# Altium schematic sheet Modulo_Generico.SchDoc
size A4
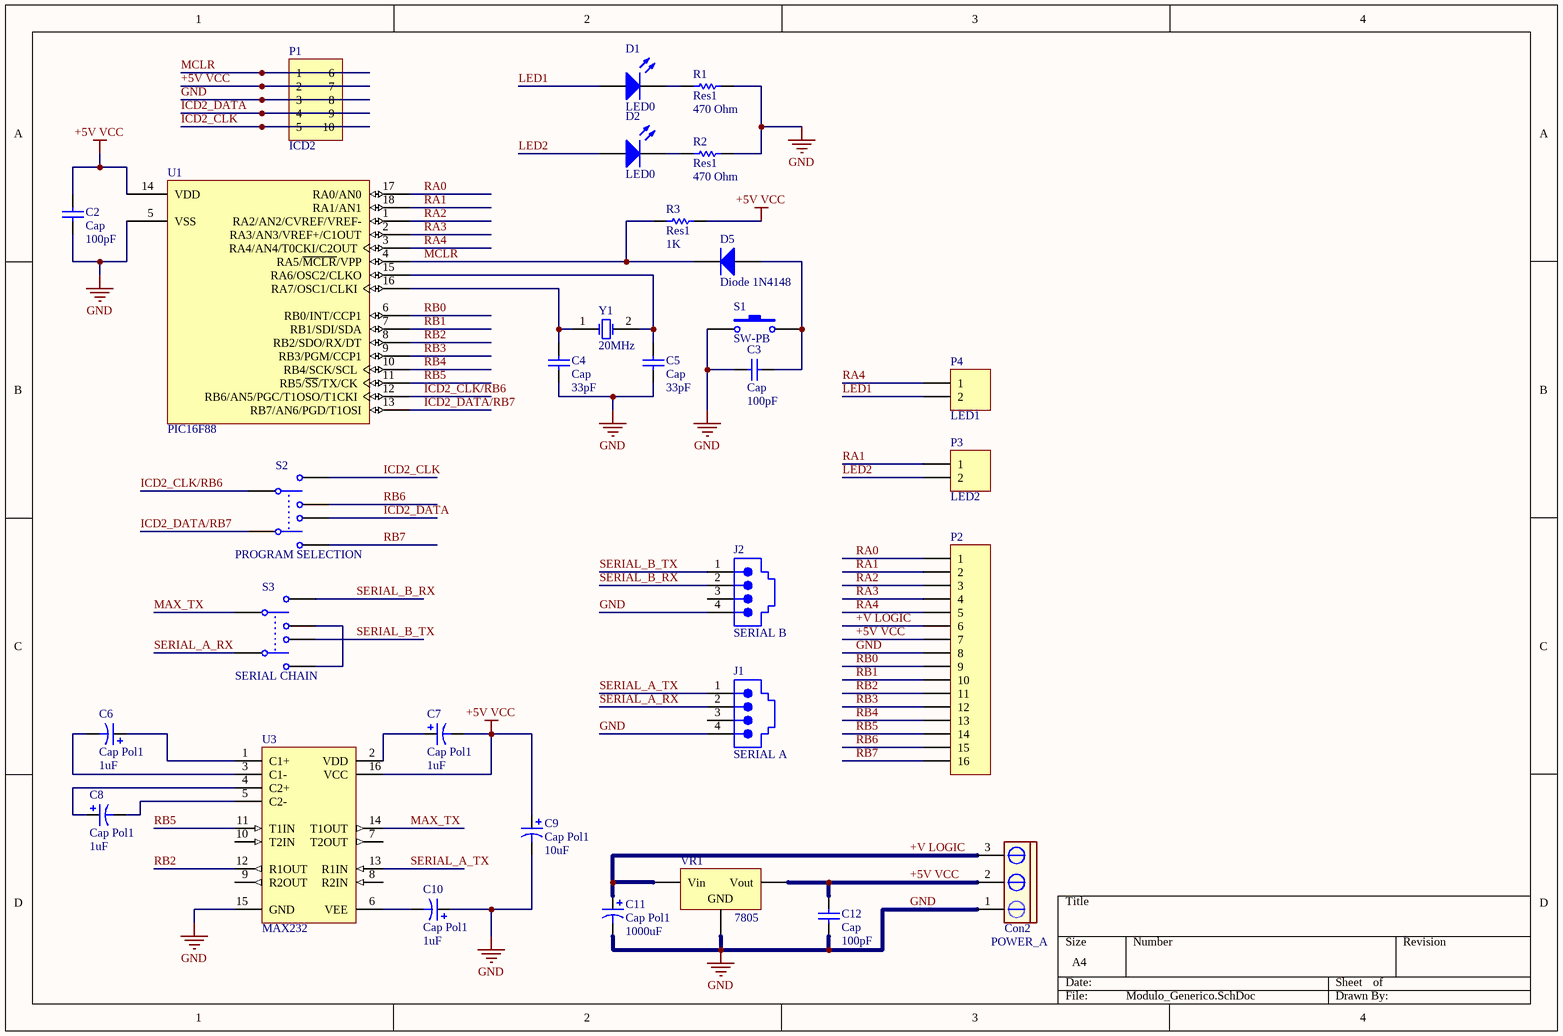
[diagram p0: Modulo_Generico.SchDoc]

## Parts
C2  Cap  value 100pF  [CAPR2.54-5.1x3.2]
C3  Cap  value 100pF  [CAPR2.54-5.1x3.2]
C4  Cap  value 33pF  [CAPR2.54-5.1x3.2]
C5  Cap  value 33pF  [CAPR2.54-5.1x3.2]
C6  Cap Pol1  value 1uF  [CAPPR2-5x6.8]
C7  Cap Pol1  value 1uF  [CAPPR2-5x6.8]
C8  Cap Pol1  value 1uF  [CAPPR2-5x6.8]
C9  Cap Pol1  value 10uF  [CAPPR2-5x6.8]
C10  Cap Pol1  value 1uF  [CAPPR2-5x6.8]
C11  Cap Pol1  value 1000uF  [RB5-10.5]
C12  Cap  value 100pF  [CAPR2.54-5.1x3.2]
Con2  POWER_A  [My_CN3]
D1  LED0  [LED-0]
D2  LED0  [LED-0]
D5  Diode 1N4148  [DIO7.1-3.9x1.9]
J1  SERIAL A  [15-43-6245]
J2  SERIAL B  [15-43-6245]
P1  ICD2  [HEADER10_5x2_B]
P2  Header 16  [My_1X16]  (value not drawn)
P3  LED2  [HDR1X2]
P4  LED1  [HDR1X2]
R1  Res1  value 470 Ohm  [AXIAL-0.3]
R2  Res1  value 470 Ohm  [AXIAL-0.3]
R3  Res1  value 1K  [AXIAL-0.3]
S1  SW-PB  [TS-063]
S2  PROGRAM SELECTION  [LD-202mini]
S3  SERIAL CHAIN  [LD-202mini]
U1  PIC16F88  [PDIP300-P18]
U3  MAX232  [PE16A]
VR1  7805  [My_TO-220]
Y1  20MHz  [My_Crystal]

## Nets
+5V VCC: C2.2 C7.2 C9.1 C12.2 Con2.2 P1.2 P1.7 P2.7 R3.2 U1.14(VDD) U3.16(VCC) VR1.3(Vout)
GND: C2.1 C3.1 C4.1 C5.1 C9.2 C10.1 C11.2 C12.1 Con2.1 J1.4 J2.4 P1.3 P1.8 P2.8 R1.2 R2.2 S1.1 U1.5(VSS) U3.15(GND) VR1.2(GND)
+V LOGIC: C11.1 Con2.3 P2.6 VR1.1(Vin)
ICD2_CLK: P1.5 P1.10 S2.2
ICD2_CLK/RB6: S2.1 U1.12(RB6/AN5/PGC/T1OSO/T1CKI)
ICD2_DATA: P1.4 P1.9 S2.5
ICD2_DATA/RB7: S2.4 U1.13(RB7/AN6/PGD/T1OSI)
LED1: D1.1(A) P4.2
LED2: D2.1(A) P3.2
MAX_TX: S3.1 U3.14(T1OUT)
MCLR: D5.2(K) P1.1 P1.6 R3.1 U1.4(RA5/~{MCLR}/VPP)
RA0: P2.1 U1.17(RA0/AN0)
RA1: P2.2 P3.1 U1.18(RA1/AN1)
RA2: P2.3 U1.1(RA2/AN2/CVREF/VREF-)
RA3: P2.4 U1.2(RA3/AN3/VREF+/C1OUT)
RA4: P2.5 P4.1 U1.3(RA4/AN4/T0CKI/C2OUT)
RB0: P2.9 U1.6(RB0/INT/CCP1)
RB1: P2.10 U1.7(RB1/SDI/SDA)
RB2: P2.11 U1.8(RB2/SDO/RX/DT) U3.12(R1OUT)
RB3: P2.12 U1.9(RB3/PGM/CCP1)
RB4: P2.13 U1.10(RB4/SCK/SCL)
RB5: P2.14 U1.11(RB5/~{SS}/TX/CK) U3.11(T1IN)
RB6: P2.15 S2.3
RB7: P2.16 S2.6
SERIAL_A_RX: J1.2 S3.4
SERIAL_A_TX: J1.1 U3.13(R1IN)
SERIAL_B_RX: J2.2 S3.2
SERIAL_B_TX: J2.1 S3.5
NetC3_2: C3.2 D5.1(A) S1.2
NetC4_2: C4.2 U1.16(RA7/OSC1/CLKI) Y1.1(OSC1)
NetC5_2: C5.2 U1.15(RA6/OSC2/CLKO) Y1.2(OSC2)
NetC6_1: C6.1 U3.1(C1+)
NetC6_2: C6.2 U3.3(C1-)
NetC7_1: C7.1 U3.2(VDD)
NetC8_1: C8.1 U3.4(C2+)
NetC8_2: C8.2 U3.5(C2-)
NetC10_2: C10.2 U3.6(VEE)
NetD1_2: D1.2(K) R1.1
NetD2_2: D2.2(K) R2.1
NetS3_3: S3.3 S3.6

Not connected (* = marked no-connect by the designer): J1 3; J2 3; U3 7(T2OUT) 8(R2IN) 9(R2OUT) 10(T2IN)

## Library data of the parts
C2-C5 C12 = Cap: Capacitor; Published: 8-Jun-2000; LatestRevisionDate: 17-Jul-2002; LatestRevisionNote: Re-released for DXP Platform.; PackageReference: RAD-0.3; Publisher: Altium Limited
C6-C11 = Cap Pol1: Polarized Capacitor (Radial); Published: 8-Jun-2000; LatestRevisionDate: 17-Jul-2002; LatestRevisionNote: Re-released for DXP Platform.; PackageReference: RB7.6-15; Publisher: Altium Limited
Con2 = CON3 pin Green: Connector green screw
D1 D2 = LED0: Typical INFRARED GaAs LED; Published: 8-Jun-2000; LatestRevisionDate: 08-Jul-2005; LatestRevisionNote: Mech Layer 1 removed.; PackageReference: LED-0; Publisher: Altium Limited
D5 = Diode 1N4148: High Conductance Fast Diode; Published: 8-Jun-2000; LatestRevisionDate: 17-Jul-2002; LatestRevisionNote: Re-released for DXP Platform.; DatasheetVersion: 1997; PackageReference: DO-35; Publisher: Altium Limited; Code_JEDEC: DO-204-AH; ComponentLink1Description: Manufacturer Link; ComponentLink1URL: http://www.fairchildsemi.com/; ComponentLink2Description: Datasheet; ComponentLink2URL: http://www.fairchildsemi.com/ds/1N%2F1N4148.pdf
J1 J2 = 15-43-6245: Right Angle, Standard Profile, RJ45-Keyed, Flange Mount PCB Jack; Ports: 1; Positions/Loaded: Port1 - 8 Keyed/4; PerformanceCategory: 3; PCB_Mounting: Thru-Hole; ComponentAvailability: Obsolete; DrillSize: Nominal, Rounded to nearest 0.05mm; PCB_Layout: Complies with Manufacturer's Recommendation.; Published: 25-Jun-2002; DatasheetDocument: 18-Dec-2001; PackageDocument: 18-Dec-2001; PackageReference: 15-43-6245; Publisher: Altium Limited; ComponentLink1Description: Manufacturer Link; ComponentLink1URL: http://www.molex.com/; ComponentLink2Description: Datasheet; ComponentLink2URL: http://www.molex.com/cmc_upload/common_files/1212003_catalogmx41314.pdf; ComponentLink3Description: Iges Model; ComponentLink3URL: http://www.molex.com/pdm_docs/igs/15-43-6233_igs.zip
P1 = Header 5X2A: Header, 5-Pin, Dual row; LatestRevisionDate: 17-Jul-2002; LatestRevisionNote: Re-released for DXP Platform.; Publisher: Altium Limited
P2 = Header 16: Header, 16-Pin; LatestRevisionDate: 17-Jul-2002; LatestRevisionNote: Re-released for DXP Platform.; Publisher: Altium Limited
P3 P4 = Header 2: Header, 2-Pin; LatestRevisionDate: 17-Jul-2002; LatestRevisionNote: Re-released for DXP Platform.; Publisher: Altium Limited
R1-R3 = Res1: Resistor; Published: 8-Jun-2000; LatestRevisionDate: 17-Jul-2002; LatestRevisionNote: Re-released for DXP Platform.; PackageReference: AXIAL-0.3; Publisher: Altium Limited
S1 = SW-PB: Switch; Published: 24-Mar-1999; LatestRevisionDate: 17-Jul-2002; LatestRevisionNote: Re-released for DXP Platform.; PackageReference: SPST-2; Publisher: Altium Limited
S2 S3 = SW-DPDT: Double-Pole, Double-Throw Switch; Published: 24-Mar-1999; LatestRevisionDate: 17-Jul-2002; LatestRevisionNote: Re-released for DXP Platform.; PackageReference: DPDT-6; Publisher: Altium Limited
U1 = PIC16F88-E/P: Enhanced FLASH Microcontroller with nanoWatt Technology, 10-Bit A/D, 4K (x14-Bit words) FLASH, 368 Bytes RAM, 18-Pin PDIP, Standard VDD Range, Extended Temperature; Note: The CCP1 pin is determined by CCPMX in Configuration Word 1 register.; Published: 11-Oct-2004; LatestRevisionDate: 29-Jan-2009; LatestRevisionNote: Sch. layout revised. 3D Model Removed.; DatasheetVersion: revC, Jan-2005; PackageVersion: revAW, Oct-2008; PackageReference: PDIP300-P18; Publisher: Altium Limited; PackageDescription: 18-Lead Plastic Dual In-Line (P) - 300 mil Body [PDIP]; Code_JEDEC: MS-001; ComponentLink1Description: Manufacturer Link; ComponentLink1URL: http://www.microchip.com; ComponentLink2Description: Datasheet; ComponentLink2URL: http://ww1.microchip.com/downloads/en/DeviceDoc/30487b.pdf; ComponentLink3Description: Packaging Specification; ComponentLink3URL: http://ww1.microchip.com/downloads/en/PackagingSpec/00049AW.pdf
U3 = MAX232ACPE: +5V Powered, Multi-Channel RS-232 Driver/Receiver; Published: 16-Jan-2001; LatestRevisionDate: 29-May-2009; LatestRevisionNote: Component Body Added.; PackageVersion: 1997; PackageReference: PE16A; Publisher: Altium Limited; PackageDescription: DIP, 16-Pin, Row Spacing 7.62 mm, Pitch 2.54 mm; Code_JEDEC: MS-001-BB; ComponentLink1Description: Manufacturer Link; ComponentLink1URL: http://www.maxim-ic.com/; ComponentLink2Description: Datasheet; ComponentLink2URL: http://pdfserv.maxim-ic.com/en/ds/MAX220-MAX249.pdf
VR1 = Volt Reg: Voltage Regulator; Published: 24-Mar-1999; LatestRevisionDate: 29-May-2009; LatestRevisionNote: IPC-7351 Footprint Added.; PackageReference: D2PAK; Publisher: Altium Limited; PackageDescription: 3-Pin Transistor Outline Package 2.54 mm Pitch, 15.1 mm Lead Span
Y1 = XTAL: Crystal Oscillator; Published: 8-Jun-2000; LatestRevisionDate: 17-Jul-2002; LatestRevisionNote: Re-released for DXP Platform.; PackageReference: R38; Publisher: Altium Limited